# Altium schematic sheet Clocks.SchDoc
size A4
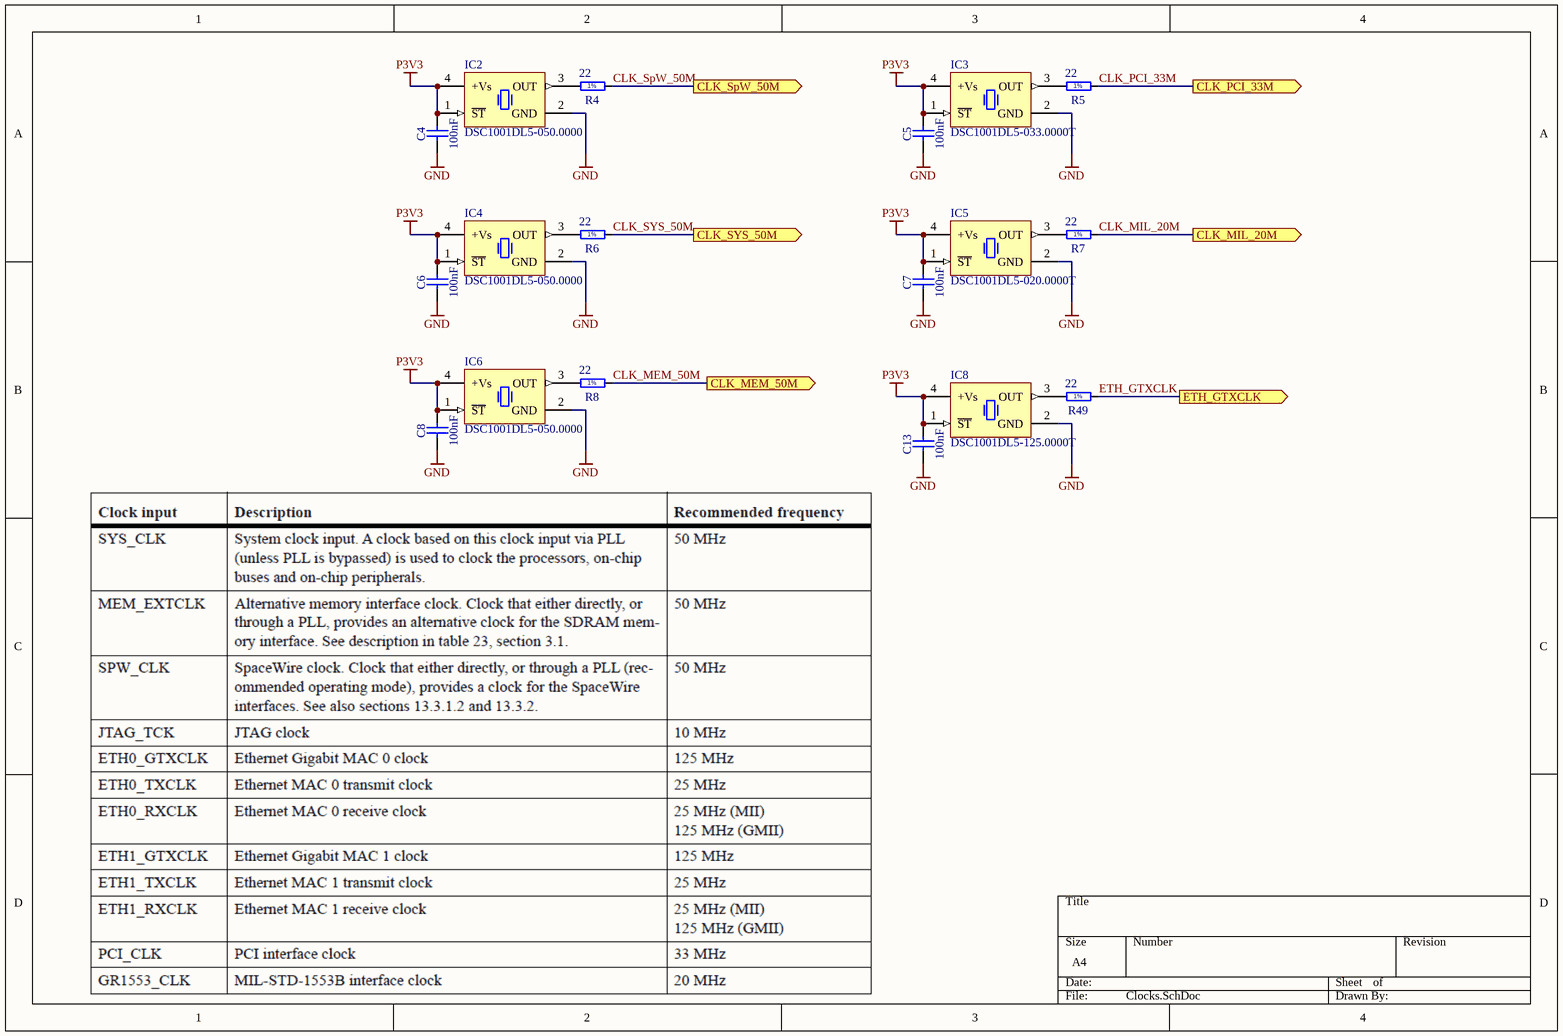
[diagram p0: Clocks.SchDoc]

## Parts
C4  100nF  [CAPC0603X33N]
C5  100nF  [CAPC0603X33N]
C6  100nF  [CAPC0603X33N]
C7  100nF  [CAPC0603X33N]
C8  100nF  [CAPC0603X33N]
C13  100nF  [CAPC0603X33N]
IC2  DSC1001DL5-050.0000  [OSC_MICREL_2520]
IC3  DSC1001DL5-033.0000T  [OSC_MICREL_2520]
IC4  DSC1001DL5-050.0000  [OSC_MICREL_2520]
IC5  DSC1001DL5-020.0000T  [OSC_MICREL_2520]
IC6  DSC1001DL5-050.0000  [OSC_MICREL_2520]
IC8  DSC1001DL5-125.0000T  [OSC_MICREL_2520]
R4  22  [RESC1005X40N]
R5  22  [RESC1005X40N]
R6  22  [RESC1005X40N]
R7  22  [RESC1005X40N]
R8  22  [RESC1005X40N]
R49  22  [RESC1005X40N]

## Ports
CLK_MEM_50M (out), CLK_MIL_20M (out), CLK_PCI_33M (out), CLK_SpW_50M (out), CLK_SYS_50M (out), ETH_GTXCLK (out)

## Nets
GND: C4.1 C5.1 C6.1 C7.1 C8.1 C13.1 IC2.2(GND) IC3.2(GND) IC4.2(GND) IC5.2(GND) IC6.2(GND) IC8.2(GND)
P3V3: C4.2 C5.2 C6.2 C7.2 C8.2 C13.2 IC2.1(~{ST}) IC2.4(+Vs) IC3.1(~{ST}) IC3.4(+Vs) IC4.1(~{ST}) IC4.4(+Vs) IC5.1(~{ST}) IC5.4(+Vs) IC6.1(~{ST}) IC6.4(+Vs) IC8.1(~{ST}) IC8.4(+Vs)
CLK_MEM_50M: R8.2 ; port CLK_MEM_50M
CLK_MIL_20M: R7.2 ; port CLK_MIL_20M
CLK_PCI_33M: R5.2 ; port CLK_PCI_33M
CLK_SpW_50M: R4.2 ; port CLK_SpW_50M
CLK_SYS_50M: R6.2 ; port CLK_SYS_50M
ETH_GTXCLK: R49.2 ; port ETH_GTXCLK
NetIC2_3: IC2.3(OUT) R4.1
NetIC3_3: IC3.3(OUT) R5.1
NetIC4_3: IC4.3(OUT) R6.1
NetIC5_3: IC5.3(OUT) R7.1
NetIC6_3: IC6.3(OUT) R8.1
NetIC8_3: IC8.3(OUT) R49.1

## Notes on the sheet
- (in symbol R0402_22R_1%_0.0625W_100PPM) 1%

## Library data of the parts
C4-C8 C13 = CC0201_100NF_6.3V_10%_X5R: Non-polarised capacitor; Manufacturer: GENERIC; Part Description: SMD Multilayer Chip Ceramic Capacitor; Manufacturer1 Part Number: 02016D104KAT2A; Voltage: 6.3V; TC: X5R; Tolerance: ±10%; Part Number: CC0201_100NF_6.3V_10%_X5R; Component Kind: Standard; Component Type: Standard; Pin Count: 2; Value: 100nF; Status: Not Recommended; Manufacturer Part Number: CC0201_100NF_6.3V_10%_X5R; Case: 0201; Mounted: Yes; Socket: No; SMD: Yes; Sense: No; Manufacturer1 Example: AVX; Manufacturer1 ComponentHeight: 0.33mm; HelpURL: \\cern.ch\dfs\Applications\Altium\Datasheets\CC0201_X5R_AVX.pdf; Author: CERN DEM JLC; CreateDate: 03/12/2007; LatestRevisionDate: 03/12/2007
IC2 IC4 IC6 = OSC_DSC1001DL5-100.0000: MEMS 50MHz oscillator; Manufacturer: Micrel; Part Description: MEMS Oscillator 50MHz; Bonding: No; PressFit: No; Case: *; Component Kind: Standard; Component Type: Standard; ComponentHeigth: *; CreateDate: 2018-01-01; Device: DSC1001DL5-050.0000; Footprint: *; HelpURL: *; LatestRevisionDate: 2018-01-01; Manufacturer Part Number: DSC1001DL5-050.0000; Mounted: Yes; PackageDescription: MICREL SMD Oscillator, QFN, 4 pins, 2.5mm x 2.0mm; Part Number: DSC1001DL5-050.0000; Pin Count: 4; Sense: No; SMD: Yes; Socket: No; Value: *
IC3 = OSC_DSC1001DL5-100.0000: MEMS 33MHz oscillator; Manufacturer: Micrel; Part Description: MEMS Oscillator 33MHz; Bonding: No; PressFit: No; Case: *; Component Kind: Standard; Component Type: Standard; ComponentHeigth: *; CreateDate: 2018-01-01; Device: DSC1001DL5-033.0000T; Footprint: *; HelpURL: *; LatestRevisionDate: 2018-01-01; Manufacturer Part Number: DSC1001DL5-033.0000T; Mounted: Yes; PackageDescription: MICREL SMD Oscillator, QFN, 4 pins, 2.5mm x 2.0mm; Part Number: DSC1001DL5-033.0000T; Pin Count: 4; Sense: No; SMD: Yes; Socket: No; Value: *
IC5 = OSC_DSC1001DL5-100.0000: MEMS 20MHz oscillator; Manufacturer: Micrel; Part Description: MEMS Oscillator 20MHz; Bonding: No; PressFit: No; Case: *; Component Kind: Standard; Component Type: Standard; ComponentHeigth: *; CreateDate: 2018-01-01; Device: DSC1001DL5-020.0000T; Footprint: *; HelpURL: *; LatestRevisionDate: 2018-01-01; Manufacturer Part Number: DSC1001DL5-020.0000T; Mounted: Yes; PackageDescription: MICREL SMD Oscillator, QFN, 4 pins, 2.5mm x 2.0mm; Part Number: DSC1001DL5-020.0000T; Pin Count: 4; Sense: No; SMD: Yes; Socket: No; Value: *
IC8 = OSC_DSC1001DL5-100.0000: MEMS 125MHz oscillator; Manufacturer: Micrel; Part Description: MEMS Oscillator 125MHz; Bonding: No; PressFit: No; Case: *; Component Kind: Standard; Component Type: Standard; ComponentHeigth: *; CreateDate: 2018-01-01; Device: DSC1001DL5-125.0000T; Footprint: *; HelpURL: *; LatestRevisionDate: 2018-01-01; Manufacturer Part Number: DSC1001DL5-125.0000T; Mounted: Yes; PackageDescription: MICREL SMD Oscillator, QFN, 4 pins, 2.5mm x 2.0mm; Part Number: DSC1001DL5-125.0000T; Pin Count: 4; Sense: No; SMD: Yes; Socket: No; Value: *
R4-R8 R49 = R0402_22R_1%_0.0625W_100PPM: Resistor - 1%; Part Description: General Purpose Thick Film Chip Resistor; Manufacturer: GENERIC; Manufacturer1 Part Number: 232270672209L; TC: ±100ppm/°C; PressFit: No; Part Number: R0402_22R_1%_0.0625W_100PPM; Component Kind: Standard; Component Type: Standard; Pin Count: 2; Value: 22; Status: Not Recommended; Power: 0.0625W; Tolerance: ±1%; Manufacturer Part Number: R0402_22R_1%_0.0625W_100PPM; Case: 0402; Mounted: Yes; Sense: No; Socket: No; SMD: Yes; Manufacturer1 Example: YAGEO PHYCOMP; Manufacturer1 ComponentHeight: 0.4mm; HelpURL: \\cern.ch\dfs\Applications\Altium\Datasheets\R0402_Phycomp_RC0402.pdf; Author: CERN DEM JLC; CreateDate: 03/12/2007; LatestRevisionDate: 17/10/2012